# Altium schematic sheet HV_to_LV_Power_Supply.SchDoc
size A
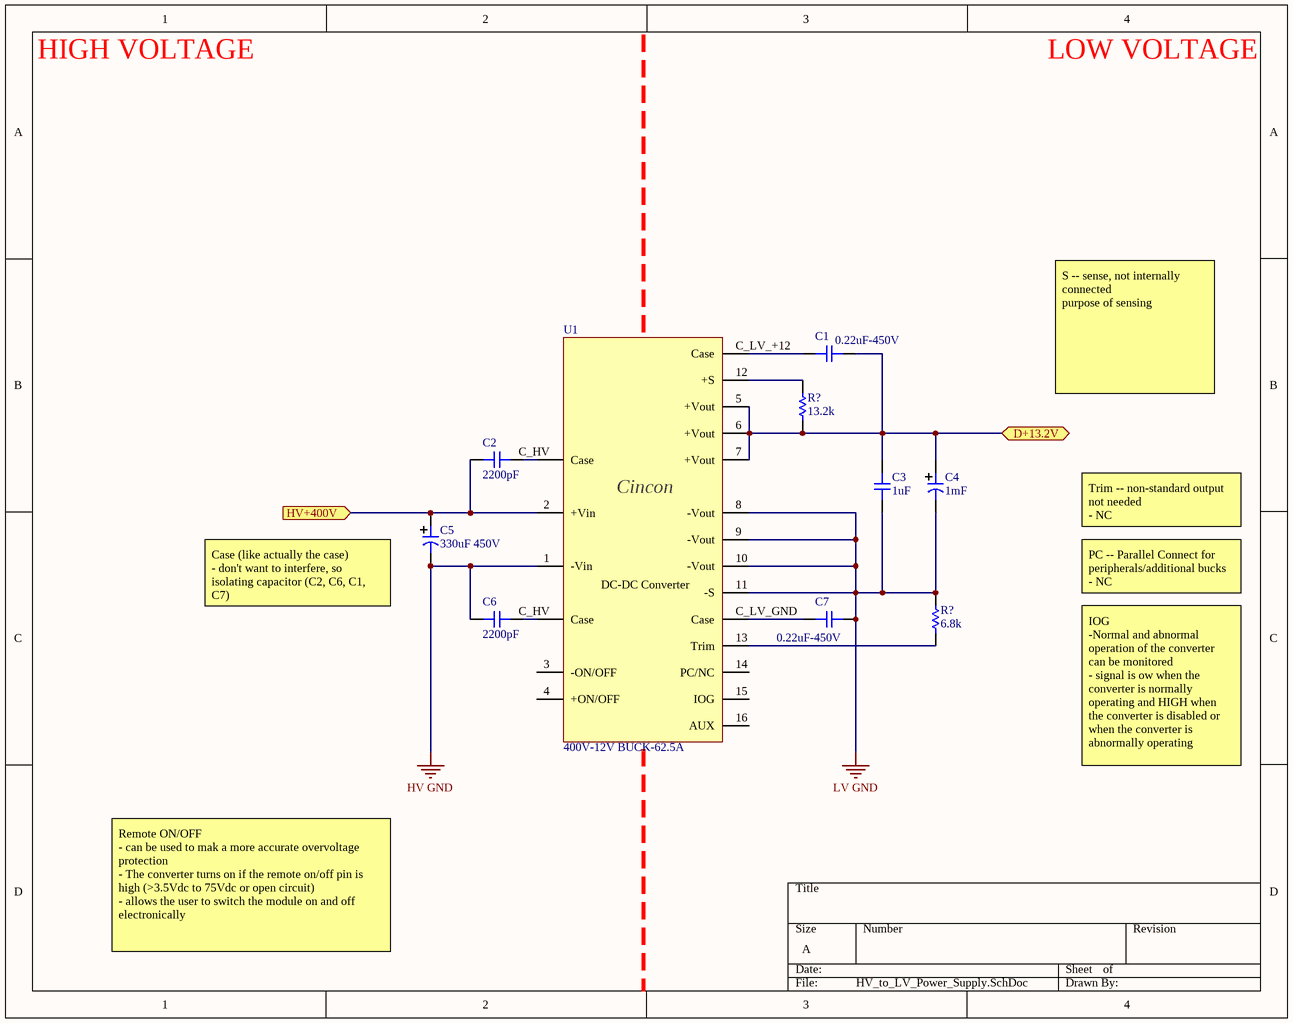
[diagram p0: HV_to_LV_Power_Supply.SchDoc]

## Parts
(Parts that share a designator on the sheet are numbered #1, #2 ... from top to bottom, then left to right.)
C1  0.22uF-450V  [CAPC3025X28N]
C2  2200pF  [CAP-0805]
C3  1uF  [CAPC3025X28N]
C4  1mF  [CAPAE146136X170M]
C5  330uF 450V  [AEC 380LQ331M450A022]
C6  2200pF  [CAP-0805]
C7  0.22uF-450V  [CAPC3025X28N]
R?#1  13.2k  [RES-0603]
R?#2  6.8k  [RES-0603]
U1  400V-12V BUCK-62.5A  [CFB750-300S12]

## Ports
D+13.2V (bidir), HV+400V (in)

## Nets
HV GND: C5.2 C6.2 U1.1(-Vin)
LV GND: C3.1 C4.2 C7.2 R?#2.2 U1.8(-Vout) U1.9(-Vout) U1.10(-Vout) U1.11(-S)
D+13.2V: C1.2 C3.2 C4.1(+) R?#1.1 U1.5(+Vout) U1.6(+Vout) U1.7(+Vout) ; port D+13.2V
HV+400V: C2.2 C5.1(+) U1.2(+Vin) ; port HV+400V
NetC1_1: C1.1 U1.C_LV_+12(Case)
NetC2_1: C2.1 U1.C_HV(Case)
NetC6_1: C6.1 U1.C_HV(Case)
NetC7_1: C7.1 U1.C_LV_GND(Case)
NetR?#1_2: R?#1.2 U1.12(+S)
NetR?#2_1: R?#2.1 U1.13(Trim)

Not connected (* = marked no-connect by the designer): U1 3(-ON/OFF) 4(+ON/OFF) 14(PC/NC) 15(IOG) 16(AUX)

## Notes on the sheet
- HIGH VOLTAGE
- LOW VOLTAGE
- S -- sense, not internally connected
  purpose of sensing
- Trim -- non-standard output
  not needed
  - NC
- (near C5) Case (like actually the case)
  - don't want to interfere, so isolating capacitor (C2, C6, C1, C7)
- PC -- Parallel Connect for peripherals/additional bucks
  - NC
- IOG
  -Normal and abnormal operation of the converter can be monitored
  - signal is ow when the converter is normally operating and HIGH when the converter is disabled or when the converter is abnormally operating
- Remote ON/OFF
  - can be used to mak a more accurate overvoltage protection
  - The converter turns on if the remote on/off pin is high (>3.5Vdc to 75Vdc or open circuit)
  - allows the user to switch the module on and off electronically
- (in symbol Cincon CFB750-300S12) Cincon; DC-DC Converter

## Library data of the parts
C1 C7 = 0.22uF-450V-1210: CAP CER 0.22UF 450V X7T 1210; Manufacturer: TDK; Manufacturer Part Number: C3225X7T2W224K200AE; Capacitance: 220nF; Tolerance: 10%; Supplier 1: Digi-Key; RoHS: Yes; Category: Ceramic Capacitors; Stock 1: 22849; Pricing 1: 1=0.90000, 10=0.66200, 50=0.52980, 100=0.45410, 500=0.35948 (USD); Mount: Surface Mount; Case/Package: 1210; Case Code (Imperial): 1210; Case Code (Metric): 3225; Weight: 0.000564oz; Min Operating Temperature: -55°C; Max Operating Temperature: 125°C; Packaging: Tape and Reel; Voltage Rating: 450V; Voltage Rating (DC): 450V; Package Quantity: 1000; Dielectric: X7T; Termination: SMD/SMT; Resistor Type: Ceramic; Features: Soft Termination; Series: C; Length: 3.2mm; Width: 2.5mm; Height: 2mm; Thickness: 0.098inch; Depth: 2.5mm; RoHS Compliant: Yes; ComponentLink1URL: https://datasheet.ciiva.com/24219/c3225x7t2w224k200ae-265393-24219702.pdf?src-supplier=Mouser; ComponentLink1Description: https://datasheet.ciiva.com/24219/c3225x7t2w224k200ae-265393-24219702.pdf?src-supplier=Mouser; Supplier Part Number 1: 445-8909-1-ND
C2 C6 = 2200pF-450V-0805: Cap Ceramic 0.0022uF 450V C0G 5% Pad SMD 0805 Soft Termination 125C Automotive T/R CGA4F4C0G2W222J085AE; Manufacturer: TDK; Supplier 1: Digi-Key; Manufacturer Part Number: CGA4F4C0G2W222J085AE; RoHS: Yes; Category: Ceramic Capacitors; Stock 1: 9544; Pricing 1: 1=0.51000, 10=0.35600, 50=0.24940, 100=0.21380, 500=0.16038, 1000=0.13543 (USD); RoHS Compliant: Yes; Supplier Part Number 1: 445-175690-1-ND
C3 = 1uF-50V-1210: CAP CER 1UF 50V X7R 1210 CL32B105KBHNNNE; Manufacturer: Samsung; Material: Ceramic; Tolerance: 10%; Supplier 1: Digi-Key; Manufacturer Part Number: CL32B105KBHNNNE; RoHS: Yes; Category: Ceramic Capacitors; Stock 1: 27840; Pricing 1: 1=0.26000, 10=0.17800, 50=0.11900, 100=0.10110, 500=0.07134, 1000=0.06243 (USD); Mount: Surface Mount; Case/Package: 1210; Case Code (Metric): 3225; Case Code (Imperial): 1210; Min Operating Temperature: -55°C; Max Operating Temperature: 125°C; Packaging: Tape and Reel; Package Quantity: 1; Capacitance: 1uF; Voltage Rating: 50V; Dielectric: X7R; Voltage: 50V; Series: CL; Construction: Flat; Length: 3.2mm; Width: 0.098inch; Height: 1.6mm; Thickness: 0.071inch; Depth: 2.5mm; Radiation Hardening: No; RoHS Compliant: Yes; ComponentLink1URL: https://datasheet.ciiva.com/15196/getdatasheetpartid-355242-15196145.pdf?src-supplier=Verical; ComponentLink1Description: https://datasheet.ciiva.com/15196/getdatasheetpartid-355242-15196145.pdf?src-supplier=Verical; ComponentLink2URL: https://datasheet.ciiva.com/29202/451199-da-01-en-vs-kondensator-1210-29202487.pdf?src-supplier=Conrad; ComponentLink2Description: https://datasheet.ciiva.com/29202/451199-da-01-en-vs-kondensator-1210-29202487.pdf?src-supplier=Conrad; ComponentLink3URL: https://datasheet.ciiva.com/16369/cl05b104kq5nnnc-16369702.pdf?src-supplier=Future+Electronics; ComponentLink3Description: https://datasheet.ciiva.com/16369/cl05b104kq5nnnc-16369702.pdf?src-supplier=Future+Electronics; Supplier Part Number 1: 1276-1811-1-ND
C4 = AEC-1mF-25V: CAP ALUM 1000UF 20% 25V SMD UUG1E102MNQ1MS; Manufacturer: Nichicon; Ripple Current: 820mA; Leakage Current: 10uA; Life (Hours): 2000Hour; Dissipation Factor: 0.16%; Supplier 1: Digi-Key; Manufacturer Part Number: UUG1E102MNQ1MS; RoHS: Yes; Category: Aluminum Electrolytic Capacitors; Stock 1: 77; Pricing 1: 1=1.53000, 10=1.20500, 50=1.04480 (USD); Mount: Surface Mount; Case/Package: Radial; Min Operating Temperature: -40°C; Max Operating Temperature: 85°C; Package Quantity: 1; Voltage Rating: 25V; Voltage Rating (DC): 25V; Tolerance: 20%; Packaging: Tape and Reel; Capacitance: 1mF; Termination: SMD/SMT; Ripple Current (AC): 820mA; Series: UG; Diameter: 12.5mm; Length: 16mm; Height: 16mm; Height - Seated (Max): 0.669inch; REACH SVHC: No SVHC; Lead Free: Contains Lead; RoHS Compliant: Yes; ComponentLink1URL: https://datasheet.ciiva.com/6311/e-ug-6311782.pdf?src-supplier=Digi-Key; ComponentLink1Description: https://datasheet.ciiva.com/6311/e-ug-6311782.pdf?src-supplier=Digi-Key; ComponentLink2URL: https://datasheet.ciiva.com/6311/e-ug-6311783.pdf?src-supplier=Digi-Key; ComponentLink2Description: https://datasheet.ciiva.com/6311/e-ug-6311783.pdf?src-supplier=Digi-Key; Supplier Part Number 1: 493-7421-1-ND
C5 = AEC-330uF-450V: Aluminum Electrolytic Capacitors - Snap In 330uF 450V 20% 380LQ331M450A022; Manufacturer: Cornell Dubilier; Dielectric Material: Aluminium; Ripple Current: 2.01A; ESR (Equivalent Series Resistance): 603mR; Life (Hours): 2000Hour; Supplier 1: Digi-Key; Manufacturer Part Number: 380LQ331M450A022; RoHS: Yes; Category: Aluminum Electrolytic Capacitors; Stock 1: 2991; Pricing 1: 1=6.30000, 10=5.67000, 50=4.91400, 100=4.28400, 500=3.52800, 1000=3.27600, 2500=3.21300, 5000=3.19200 (USD); Mount: Through Hole; Case/Package: Radial; Number of Pins: 2; Weight: 1.69315oz; Min Operating Temperature: -25°C; Max Operating Temperature: 85°C; Package Quantity: 40; Capacitance: 330uF; Voltage Rating: 450V; Tolerance: 20%; Packaging: Bulk; Voltage Rating (DC): 450V; Termination: Snap in; Features: General Purpose; Series: 380LQ; Diameter: 35mm; Length: 30mm; Height: 30mm; Height - Seated (Max): 1.181inch; Lead Pitch: 10mm; REACH SVHC: Unknown; Lead Free: Lead Free; RoHS Compliant: Yes; ComponentLink1URL: https://datasheet.ciiva.com/5372/380lq-5372414.pdf?src-supplier=Mouser; ComponentLink1Description: https://datasheet.ciiva.com/5372/380lq-5372414.pdf?src-supplier=Mouser
R?#1 = RT0603BRD0713K2L: High Precision-High Stability Chip Resistor Thin Film 0603 13.2kOhm 0.1% Paper T/R; Manufacturer: Yageo; Resistance: 13.2kR; Max Power Dissipation: 100mW; Temperature Coefficient: 25ppm/°C; Supplier 1: Mouser; Manufacturer Part Number: RT0603BRD0713K2L; RoHS: Yes; Category: Chip SMD Resistors; Stock 1: 2131; Pricing 1: 1=0.37000, 10=0.27400, 50=0.27400, 100=0.10700, 1000=0.05200, 10000=0.03700 (USD); Case/Package: 0603; Min Operating Temperature: -55°C; Max Operating Temperature: 155°C; Resistor Type: Thin Film; Packaging: Tape and Reel; Tolerance: 0.1%; Number of Terminations: 2; RoHS Compliant: Yes; ComponentLink1URL: http://www.yageo.com/documents/recent/PYu-RT_1-to-0.01_RoHS_L_9.pdf?src-supplier=Digi-Key; ComponentLink1Description: http://www.yageo.com/documents/recent/PYu-RT_1-to-0.01_RoHS_L_9.pdf?src-supplier=Digi-Key; Supplier Part Number 1: 603-RT0603BRD0713K2L
R?#2 = SFR03EZPF6801: Manufacturer: Rohm; Supplier 1: Mouser; Manufacturer Part Number: SFR03EZPF6801; RoHS: Yes; Stock 1: 14832; Pricing 1: 1=0.10000, 10=0.08800, 50=0.08800, 100=0.03400, 1000=0.01500, 10000=0.01100 (USD); RoHS Compliant: Yes; Supplier Part Number 1: 755-SFR03EZPF6801
U1 = Cincon CFB750-300S12: 750Watts Full Brick DC-DC Converter Input Voltage 200-425VDC to 12VDC, 62.5A; ComponentLink1Description: Datasheet; ComponentLink1URL: https://www.cincon.com/productdownload/CFB750-300S-series-application-note.pdf